# Altium schematic sheet driver1.SchDoc: Oncilla motor control board
size A4; DocumentNumber: 1; Revision: 3; SheetNumber: 1; SheetTotal: 5
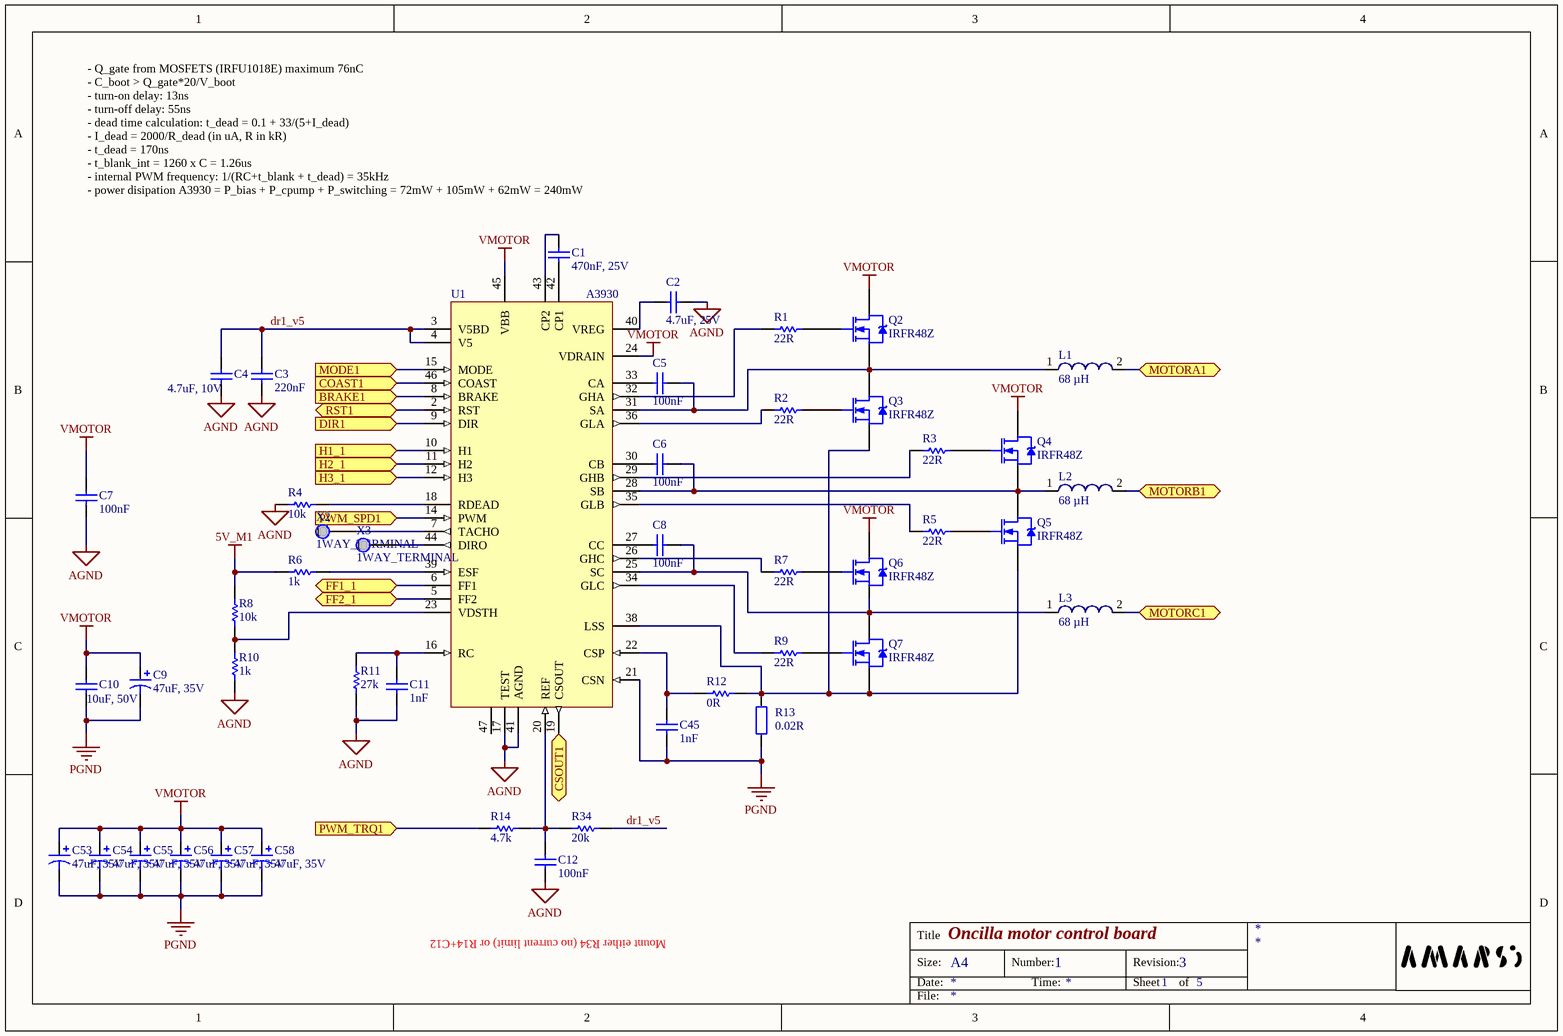
[diagram p0: driver1.SchDoc]

## Parts
C1  470nF, 25V  [CAPC1608L]
C2  4.7uF, 25V  [CAPC2512L]
C3  value 220nF  [CAPC1608L]  (hidden comment: 100nF)
C4  4.7uF, 10V  [CAPC1608L]
C5  100nF  [CAPC1608L]
C6  100nF  [CAPC1608L]
C7  100nF  [CAPC1608L]
C8  100nF  [CAPC1608L]
C9  47uF, 35V  [7343]
C10  10uF, 50V  [CAPC3216L]
C11  1nF  [CAPC1608L]
C12  100nF  [CAPC1608L]
C45  1nF  [CAPC1608L]
C53  47uF, 35V  [7343]
C54  47uF, 35V  [7343]
C55  47uF, 35V  [7343]
C56  47uF, 35V  [7343]
C57  47uF, 35V  [7343]
C58  47uF, 35V  [7343]
L1  68 µH  [IHLP-6767GZ-11]
L2  68 µH  [IHLP-6767GZ-11]
L3  68 µH  [IHLP-6767GZ-11]
Q2  IRFR48Z  [TO-252AA_N]
Q3  IRFR48Z  [TO-252AA_N]
Q4  IRFR48Z  [TO-252AA_N]
Q5  IRFR48Z  [TO-252AA_N]
Q6  IRFR48Z  [TO-252AA_N]
Q7  IRFR48Z  [TO-252AA_N]
R1  22R  [RESC1608L]
R2  22R  [RESC1608L]
R3  22R  [RESC1608L]
R4  10k  [RESC1608L]
R5  22R  [RESC1608L]
R6  1k  [RESC1608L]
R7  22R  [RESC1608L]
R8  10k  [RESC1608L]
R9  22R  [RESC1608L]
R10  1k  [RESC1608L]
R11  27k  [RESC1608L]
R12  0R  [RESC1608L]
R13  value 0.02R  [RESC6332N]  (hidden comment: 20mR)
R14  4.7k  [RESC1608L]
R34  20k  [RESC1608L]
U1  A3930  [TSQFP50P900X900X160_HS-48N]
X2  1WAY_TERMINAL  [TESTPIN 0.5mm]
X3  1WAY_TERMINAL  [TESTPIN 0.5mm]

## Ports
BRAKE1 (in), COAST1 (in), CSOUT1, DIR1 (in), FF1_1, FF2_1, H1_1 (in), H2_1 (in), H3_1 (in), MODE1 (in), MOTORA1, MOTORB1, MOTORC1, PWM_SPD1 (in), PWM_TRQ1 (in), RST1

## Nets
5V_M1: R6.1 R8.2
AGND: C2.2 C3.1 C4.1 C7.1 C11.1 C12.1 R4.1 R10.1 R11.1 U1.17(TEST) U1.41(AGND) U1.49(AGND)
PGND: C9.2 C10.1 C45.1 C53.2 C54.2 C55.2 C56.2 C57.2 C58.2 R13.1 U1.21(CSN)
VMOTOR: C7.2 C9.1 C10.2 C53.1 C54.1 C55.1 C56.1 C57.1 C58.1 Q2.4(D) Q4.4(D) Q6.4(D) U1.24(VDRAIN) U1.45(VBB)
BRAKE1: U1.8(BRAKE) ; port BRAKE1
COAST1: U1.46(COAST) ; port COAST1
CSOUT1: U1.19(CSOUT) ; port CSOUT1
DIR1: U1.9(DIR) ; port DIR1
dr1_v5: C3.2 C4.2 R34.2 U1.3(V5BD) U1.4(V5)
FF1_1: U1.6(FF1) ; port FF1_1
FF2_1: U1.5(FF2) ; port FF2_1
H1_1: U1.10(H1) ; port H1_1
H2_1: U1.11(H2) ; port H2_1
H3_1: U1.12(H3) ; port H3_1
MODE1: U1.15(MODE) ; port MODE1
MOTORA1: L1.2 ; port MOTORA1
MOTORB1: L2.2 ; port MOTORB1
MOTORC1: L3.2 ; port MOTORC1
PWM_SPD1: U1.14(PWM) ; port PWM_SPD1
PWM_TRQ1: R14.1 ; port PWM_TRQ1
RST1: U1.2(RST) ; port RST1
NetC1_1: C1.1 U1.42(CP1)
NetC1_2: C1.2 U1.43(CP2)
NetC2_1: C2.1 U1.40(VREG)
NetC5_1: C5.1 U1.33(CA)
NetC5_2: C5.2 L1.1 Q2.3(S) Q3.4(D) U1.31(SA)
NetC6_1: C6.1 U1.30(CB)
NetC6_2: C6.2 L2.1 Q4.3(S) Q5.4(D) U1.28(SB)
NetC8_1: C8.1 U1.27(CC)
NetC8_2: C8.2 L3.1 Q6.3(S) Q7.4(D) U1.25(SC)
NetC11_2: C11.2 R11.2 U1.16(RC)
NetC12_2: C12.2 R14.2 R34.1 U1.20(REF)
NetC45_2: C45.2 R12.1 U1.22(CSP)
NetQ2_1: Q2.1(G) R1.2
NetQ3_1: Q3.1(G) R2.2
NetQ3_3: Q3.3(S) Q5.3(S) Q7.3(S) R12.2 R13.2 U1.38(LSS)
NetQ4_1: Q4.1(G) R3.2
NetQ5_1: Q5.1(G) R5.2
NetQ6_1: Q6.1(G) R7.2
NetQ7_1: Q7.1(G) R9.2
NetR1_1: R1.1 U1.32(GHA)
NetR2_1: R2.1 U1.36(GLA)
NetR3_1: R3.1 U1.29(GHB)
NetR4_2: R4.2 U1.18(RDEAD)
NetR5_1: R5.1 U1.35(GLB)
NetR6_2: R6.2 U1.39(ESF)
NetR7_1: R7.1 U1.26(GHC)
NetR8_1: R8.1 R10.2 U1.23(VDSTH)
NetR9_1: R9.1 U1.34(GLC)
NetU1_7: U1.7(TACHO) X2.1
NetU1_44: U1.44(DIRO) X3.1

Not connected (* = marked no-connect by the designer): U1 47

## Notes on the sheet
- (near C1) - Q_gate from MOSFETS (IRFU1018E) maximum 76nC
  - C_boot > Q_gate*20/V_boot
  - turn-on delay: 13ns
  - turn-off delay: 55ns
  - dead time calculation: t_dead = 0.1 + 33/(5+I_dead)
  - I_dead = 2000/R_dead (in uA, R in kR)
  - t_dead = 170ns
  - t_blank_int = 1260 x C = 1.26us
  - internal PWM frequency: 1/(RC+t_blank + t_dead) = 35kHz
  - power disipation A3930 = P_bias + P_cpump + P_switching = 72mW + 105mW + 62mW = 240mW
- Mount either R34 (no current limit) or R14+C12
- Title
- Size:
- Date:
- A4
- Number:
- Time:
- Revision:
- Sheet
- of
- File:

## Library data of the parts
C1-C8 C10-C12 C45 = Cap Semi: Capacitor (Semiconductor SIM Model); Published: 8-Jun-2000; LatestRevisionDate: 29-May-2009; LatestRevisionNote: IPC-7351 Footprint Added.; PackageReference: C1206; Publisher: Altium Limited; PackageDescription: Chip Capacitor
  C1: Value: 470nF, 25V
  C2: Value: 4.7uF, 25V
  C4: Value: 4.7uF, 10V
  C5-C8 C12: Value: 100nF
  C10: Value: 10uF; Voltage: 50V
  C11 C45: Value: 1nF
C9 C53-C58 = 255D157X06R3D2T045: Note: See Data Sheet for full range of components; Published: 19-Mar-2004; DatasheetDocument: 04-Feb-2003; PackageReference: 7343; Publisher: Altium Limited; Code_JEITA: 7343; ComponentLink1Description: Manufacturer Link; ComponentLink1URL: http://www.vishay.com/; ComponentLink2Description: Datasheet; ComponentLink2URL: http://www.vishay.com/docs/40052/255d.pdf; Value: 47uF, 35V
L1-L3 = IHLP-6767GZ-11: IHLP-6767GZ-11 Low Profile, High Current Inductors
Q2-Q7 = IRFR110: HEXFET Power MOSFET; Note: Pin 2 is trimmed and is electrically connected to Drain.; Published: 8-Jun-2000; LatestRevisionDate: 20-Nov-2009; LatestRevisionNote: IPC-7351 Footprint Added.; DatasheetVersion: PD-9.524D; PackageReference: TO-252AA; Publisher: Altium Limited; PackageDescription: 3-Pin HEXFET Package 2.28 mm Pitch, 9.9 mm Lead Span; ComponentLink1Description: Manufacturer Link; ComponentLink1URL: http://www.irf.com/; ComponentLink2Description: Datasheet; ComponentLink2URL: http://www.irf.com/product-info/datasheets/data/irfr110.pdf; PackageVersion: Feb-2003; Code_JEDEC: TO-252-AA
R1-R12 R14 R34 = Res Semi: Semiconductor Resistor; Published: 8-Jun-2000; LatestRevisionDate: 17-Jul-2002; LatestRevisionNote: Re-released for DXP Platform.; PackageReference: AXIAL-0.5; Publisher: Altium Limited
  R1-R3 R5 R7 R9: Value: 22R
  R4 R8: Value: 10k
  R6 R10: Value: 1k
  R11: Value: 27k
  R12: Value: 0R
  R14: Value: 4.7k
  R34: Value: 20k
R13 = Res2: Resistor; Published: 8-Jun-2000; LatestRevisionDate: 17-Jul-2002; LatestRevisionNote: Re-released for DXP Platform.; PackageReference: AXIAL-0.4; Publisher: Altium Limited
U1 = A3930: brushless motor driver, 3-phase